# Altium schematic sheet SCH_SEGEMENTOS_HORA_2.SchDoc: TP Final - Reloj - Display Hora 2
size A4; Author: Luciano Lopez; CompanyName: UTN - FRBA; Revision: 1; SheetNumber: 6; SheetTotal: 10
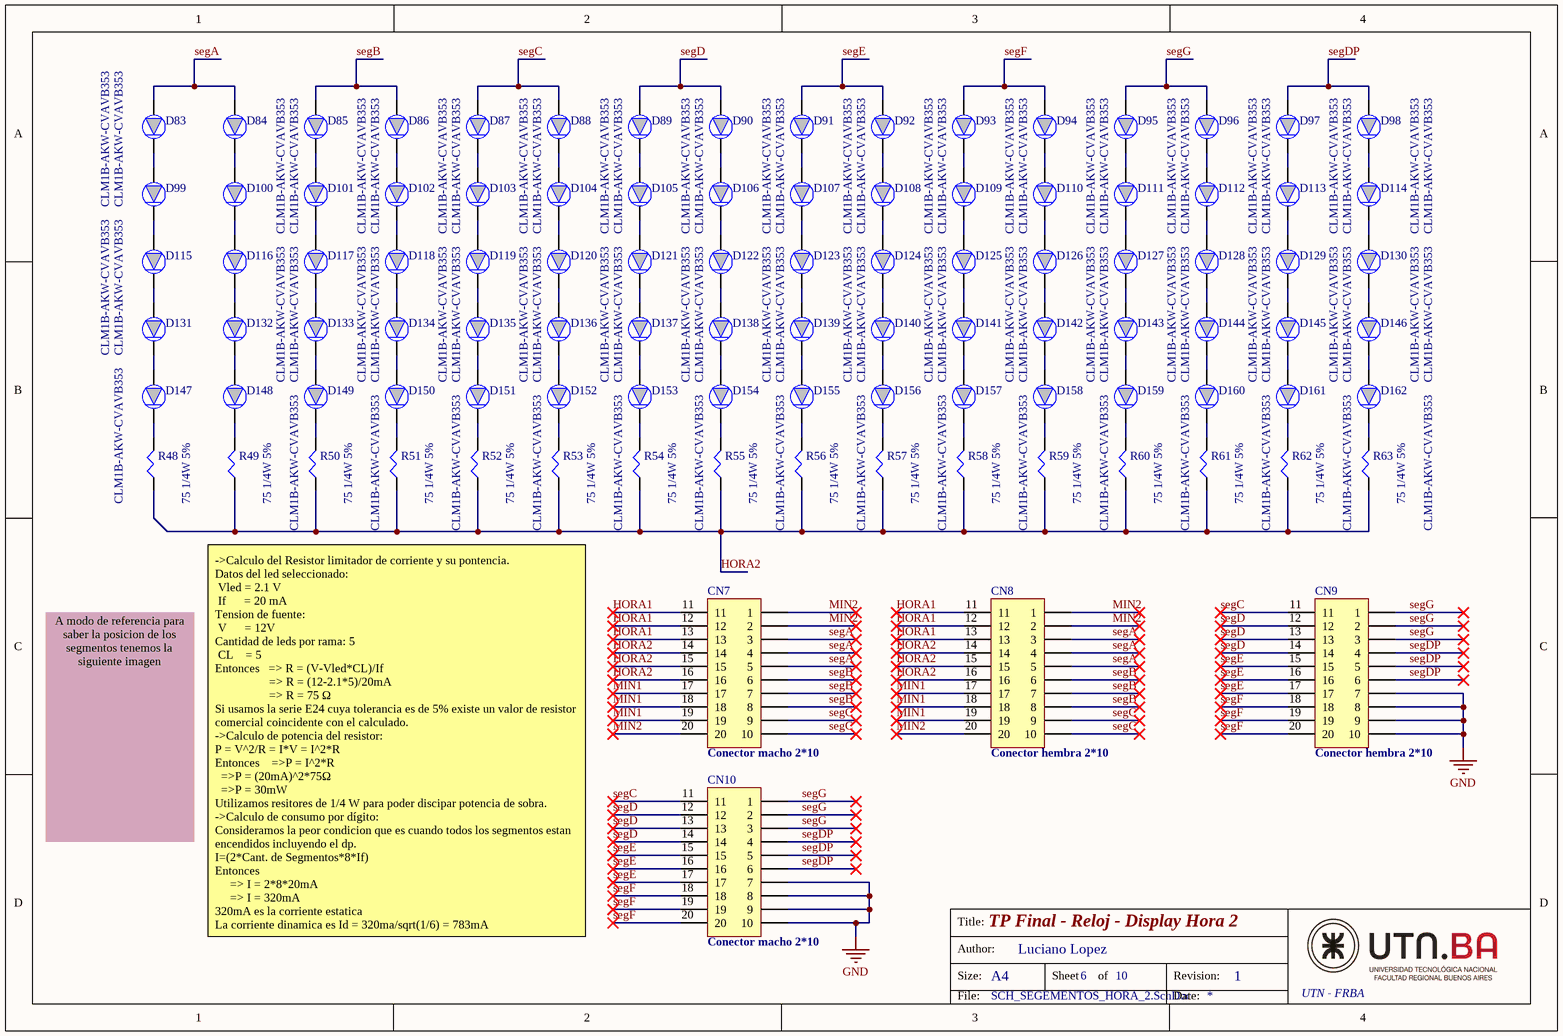
[diagram p0: SCH_SEGEMENTOS_HORA_2.SchDoc]

## Parts
CN7  Conector macho 2*10
CN8  Conector hembra 2*10
CN9  Conector hembra 2*10
CN10  Conector macho 2*10
D83  CLM1B-AKW-CVAVB353  [PLCC2_LED]
D84  CLM1B-AKW-CVAVB353  [PLCC2_LED]
D85  CLM1B-AKW-CVAVB353  [PLCC2_LED]
D86  CLM1B-AKW-CVAVB353  [PLCC2_LED]
D87  CLM1B-AKW-CVAVB353  [PLCC2_LED]
D88  CLM1B-AKW-CVAVB353  [PLCC2_LED]
D89  CLM1B-AKW-CVAVB353  [PLCC2_LED]
D90  CLM1B-AKW-CVAVB353  [PLCC2_LED]
D91  CLM1B-AKW-CVAVB353  [PLCC2_LED]
D92  CLM1B-AKW-CVAVB353  [PLCC2_LED]
D93  CLM1B-AKW-CVAVB353  [PLCC2_LED]
D94  CLM1B-AKW-CVAVB353  [PLCC2_LED]
D95  CLM1B-AKW-CVAVB353  [PLCC2_LED]
D96  CLM1B-AKW-CVAVB353  [PLCC2_LED]
D97  CLM1B-AKW-CVAVB353  [PLCC2_LED]
D98  CLM1B-AKW-CVAVB353  [PLCC2_LED]
D99  CLM1B-AKW-CVAVB353  [PLCC2_LED]
D100  CLM1B-AKW-CVAVB353  [PLCC2_LED]
D101  CLM1B-AKW-CVAVB353  [PLCC2_LED]
D102  CLM1B-AKW-CVAVB353  [PLCC2_LED]
D103  CLM1B-AKW-CVAVB353  [PLCC2_LED]
D104  CLM1B-AKW-CVAVB353  [PLCC2_LED]
D105  CLM1B-AKW-CVAVB353  [PLCC2_LED]
D106  CLM1B-AKW-CVAVB353  [PLCC2_LED]
D107  CLM1B-AKW-CVAVB353  [PLCC2_LED]
D108  CLM1B-AKW-CVAVB353  [PLCC2_LED]
D109  CLM1B-AKW-CVAVB353  [PLCC2_LED]
D110  CLM1B-AKW-CVAVB353  [PLCC2_LED]
D111  CLM1B-AKW-CVAVB353  [PLCC2_LED]
D112  CLM1B-AKW-CVAVB353  [PLCC2_LED]
D113  CLM1B-AKW-CVAVB353  [PLCC2_LED]
D114  CLM1B-AKW-CVAVB353  [PLCC2_LED]
D115  CLM1B-AKW-CVAVB353  [PLCC2_LED]
D116  CLM1B-AKW-CVAVB353  [PLCC2_LED]
D117  CLM1B-AKW-CVAVB353  [PLCC2_LED]
D118  CLM1B-AKW-CVAVB353  [PLCC2_LED]
D119  CLM1B-AKW-CVAVB353  [PLCC2_LED]
D120  CLM1B-AKW-CVAVB353  [PLCC2_LED]
D121  CLM1B-AKW-CVAVB353  [PLCC2_LED]
D122  CLM1B-AKW-CVAVB353  [PLCC2_LED]
D123  CLM1B-AKW-CVAVB353  [PLCC2_LED]
D124  CLM1B-AKW-CVAVB353  [PLCC2_LED]
D125  CLM1B-AKW-CVAVB353  [PLCC2_LED]
D126  CLM1B-AKW-CVAVB353  [PLCC2_LED]
D127  CLM1B-AKW-CVAVB353  [PLCC2_LED]
D128  CLM1B-AKW-CVAVB353  [PLCC2_LED]
D129  CLM1B-AKW-CVAVB353  [PLCC2_LED]
D130  CLM1B-AKW-CVAVB353  [PLCC2_LED]
D131  CLM1B-AKW-CVAVB353  [PLCC2_LED]
D132  CLM1B-AKW-CVAVB353  [PLCC2_LED]
D133  CLM1B-AKW-CVAVB353  [PLCC2_LED]
D134  CLM1B-AKW-CVAVB353  [PLCC2_LED]
D135  CLM1B-AKW-CVAVB353  [PLCC2_LED]
D136  CLM1B-AKW-CVAVB353  [PLCC2_LED]
D137  CLM1B-AKW-CVAVB353  [PLCC2_LED]
D138  CLM1B-AKW-CVAVB353  [PLCC2_LED]
D139  CLM1B-AKW-CVAVB353  [PLCC2_LED]
D140  CLM1B-AKW-CVAVB353  [PLCC2_LED]
D141  CLM1B-AKW-CVAVB353  [PLCC2_LED]
D142  CLM1B-AKW-CVAVB353  [PLCC2_LED]
D143  CLM1B-AKW-CVAVB353  [PLCC2_LED]
D144  CLM1B-AKW-CVAVB353  [PLCC2_LED]
D145  CLM1B-AKW-CVAVB353  [PLCC2_LED]
D146  CLM1B-AKW-CVAVB353  [PLCC2_LED]
D147  CLM1B-AKW-CVAVB353  [PLCC2_LED]
D148  CLM1B-AKW-CVAVB353  [PLCC2_LED]
D149  CLM1B-AKW-CVAVB353  [PLCC2_LED]
D150  CLM1B-AKW-CVAVB353  [PLCC2_LED]
D151  CLM1B-AKW-CVAVB353  [PLCC2_LED]
D152  CLM1B-AKW-CVAVB353  [PLCC2_LED]
D153  CLM1B-AKW-CVAVB353  [PLCC2_LED]
D154  CLM1B-AKW-CVAVB353  [PLCC2_LED]
D155  CLM1B-AKW-CVAVB353  [PLCC2_LED]
D156  CLM1B-AKW-CVAVB353  [PLCC2_LED]
D157  CLM1B-AKW-CVAVB353  [PLCC2_LED]
D158  CLM1B-AKW-CVAVB353  [PLCC2_LED]
D159  CLM1B-AKW-CVAVB353  [PLCC2_LED]
D160  CLM1B-AKW-CVAVB353  [PLCC2_LED]
D161  CLM1B-AKW-CVAVB353  [PLCC2_LED]
D162  CLM1B-AKW-CVAVB353  [PLCC2_LED]
R48  75 1/4W 5%  [R_0805]
R49  75 1/4W 5%  [R_0805]
R50  75 1/4W 5%  [R_0805]
R51  75 1/4W 5%  [R_0805]
R52  75 1/4W 5%  [R_0805]
R53  75 1/4W 5%  [R_0805]
R54  75 1/4W 5%  [R_0805]
R55  75 1/4W 5%  [R_0805]
R56  75 1/4W 5%  [R_0805]
R57  75 1/4W 5%  [R_0805]
R58  75 1/4W 5%  [R_0805]
R59  75 1/4W 5%  [R_0805]
R60  75 1/4W 5%  [R_0805]
R61  75 1/4W 5%  [R_0805]
R62  75 1/4W 5%  [R_0805]
R63  75 1/4W 5%  [R_0805]

## Nets
GND: CN9.7 CN9.8 CN9.9 CN9.10 CN10.7 CN10.8 CN10.9 CN10.10
HORA1: CN7.11 CN7.12 CN7.13 CN8.11 CN8.12 CN8.13
HORA2: CN7.14 CN7.15 CN7.16 CN8.14 CN8.15 CN8.16 R48.47 R49.47 R50.47 R51.47 R52.47 R53.47 R54.47 R55.47 R56.47 R57.47 R58.47 R59.47 R60.47 R61.47 R62.47 R63.47
MIN1: CN7.17 CN7.18 CN7.19 CN8.17 CN8.18 CN8.19
MIN2: CN7.1 CN7.2 CN7.20 CN8.1 CN8.2 CN8.20
segA: CN7.3 CN7.4 CN7.5 CN8.3 CN8.4 CN8.5 D83.12 D84.12
segB: CN7.6 CN7.7 CN7.8 CN8.6 CN8.7 CN8.8 D85.12 D86.12
segC: CN7.9 CN7.10 CN8.9 CN8.10 CN9.11 CN10.11 D87.12 D88.12
segD: CN9.12 CN9.13 CN9.14 CN10.12 CN10.13 CN10.14 D89.12 D90.12
segDP: CN9.4 CN9.5 CN9.6 CN10.4 CN10.5 CN10.6 D97.12 D98.12
segE: CN9.15 CN9.16 CN9.17 CN10.15 CN10.16 CN10.17 D91.12 D92.12
segF: CN9.18 CN9.19 CN9.20 CN10.18 CN10.19 CN10.20 D93.12 D94.12
segG: CN9.1 CN9.2 CN9.3 CN10.1 CN10.2 CN10.3 D95.12 D96.12
NetD83_11: D83.11 D99.12
NetD84_11: D84.11 D100.12
NetD85_11: D85.11 D101.12
NetD86_11: D86.11 D102.12
NetD87_11: D87.11 D103.12
NetD88_11: D88.11 D104.12
NetD89_11: D89.11 D105.12
NetD90_11: D90.11 D106.12
NetD91_11: D91.11 D107.12
NetD92_11: D92.11 D108.12
NetD93_11: D93.11 D109.12
NetD94_11: D94.11 D110.12
NetD95_11: D95.11 D111.12
NetD96_11: D96.11 D112.12
NetD97_11: D97.11 D113.12
NetD98_11: D98.11 D114.12
NetD99_11: D99.11 D115.12
NetD100_11: D100.11 D116.12
NetD101_11: D101.11 D117.12
NetD102_11: D102.11 D118.12
NetD103_11: D103.11 D119.12
NetD104_11: D104.11 D120.12
NetD105_11: D105.11 D121.12
NetD106_11: D106.11 D122.12
NetD107_11: D107.11 D123.12
NetD108_11: D108.11 D124.12
NetD109_11: D109.11 D125.12
NetD110_11: D110.11 D126.12
NetD111_11: D111.11 D127.12
NetD112_11: D112.11 D128.12
NetD113_11: D113.11 D129.12
NetD114_11: D114.11 D130.12
NetD115_11: D115.11 D131.12
NetD116_11: D116.11 D132.12
NetD117_11: D117.11 D133.12
NetD118_11: D118.11 D134.12
NetD119_11: D119.11 D135.12
NetD120_11: D120.11 D136.12
NetD121_11: D121.11 D137.12
NetD122_11: D122.11 D138.12
NetD123_11: D123.11 D139.12
NetD124_11: D124.11 D140.12
NetD125_11: D125.11 D141.12
NetD126_11: D126.11 D142.12
NetD127_11: D127.11 D143.12
NetD128_11: D128.11 D144.12
NetD129_11: D129.11 D145.12
NetD130_11: D130.11 D146.12
NetD131_11: D131.11 D147.12
NetD132_11: D132.11 D148.12
NetD133_11: D133.11 D149.12
NetD134_11: D134.11 D150.12
NetD135_11: D135.11 D151.12
NetD136_11: D136.11 D152.12
NetD137_11: D137.11 D153.12
NetD138_11: D138.11 D154.12
NetD139_11: D139.11 D155.12
NetD140_11: D140.11 D156.12
NetD141_11: D141.11 D157.12
NetD142_11: D142.11 D158.12
NetD143_11: D143.11 D159.12
NetD144_11: D144.11 D160.12
NetD145_11: D145.11 D161.12
NetD146_11: D146.11 D162.12
NetD147_11: D147.11 R48.48
NetD148_11: D148.11 R49.48
NetD149_11: D149.11 R50.48
NetD150_11: D150.11 R51.48
NetD151_11: D151.11 R52.48
NetD152_11: D152.11 R53.48
NetD153_11: D153.11 R54.48
NetD154_11: D154.11 R55.48
NetD155_11: D155.11 R56.48
NetD156_11: D156.11 R57.48
NetD157_11: D157.11 R58.48
NetD158_11: D158.11 R59.48
NetD159_11: D159.11 R60.48
NetD160_11: D160.11 R61.48
NetD161_11: D161.11 R62.48
NetD162_11: D162.11 R63.48

## Notes on the sheet
- A modo de referencia para saber la posicion de los segmentos tenemos la siguiente imagen
- ->Calculo del Resistor limitador de corriente y su pontencia.
  Datos del led seleccionado:
  Vled = 2.1 V
  If      = 20 mA
  Tension de fuente:
  V      = 12V
  Cantidad de leds por rama: 5
  CL    = 5
  Entonces   => R = (V-Vled*CL)/If
  => R = (12-2.1*5)/20mA
  => R = 75 Ω
  Si usamos la serie E24 cuya tolerancia es de 5% existe un valor de resistor comercial coincidente con el calculado.
  ->Calculo de potencia del resistor:
  P = V^2/R = I*V = I^2*R
  Entonces    =>P = I^2*R
  =>P = (20mA)^2*75Ω
  =>P = 30mW
  Utilizamos resitores de 1/4 W para poder discipar potencia de sobra.
  ->Calculo de consumo por dígito:
  Consideramos la peor condicion que es cuando todos los segmentos estan encendidos incluyendo el dp.
  I=(2*Cant. de Segmentos*8*If)
  Entonces
  => I = 2*8*20mA
  => I = 320mA
  320mA es la corriente estatica
  La corriente dinamica es Id = 320ma/sqrt(1/6) = 783mA
- Title:
- Size:
- Author:
- A4
- Sheet
- of
- Revision:
- File:
- Date:

## Library data of the parts
CN7-CN10 = CONN_2x10P: Connector Generic 10 Vias
D83-D162 = LED_DIODE
R48-R63 = Resistor